# EAGLE design schematics (EAGLE 9.3.2)
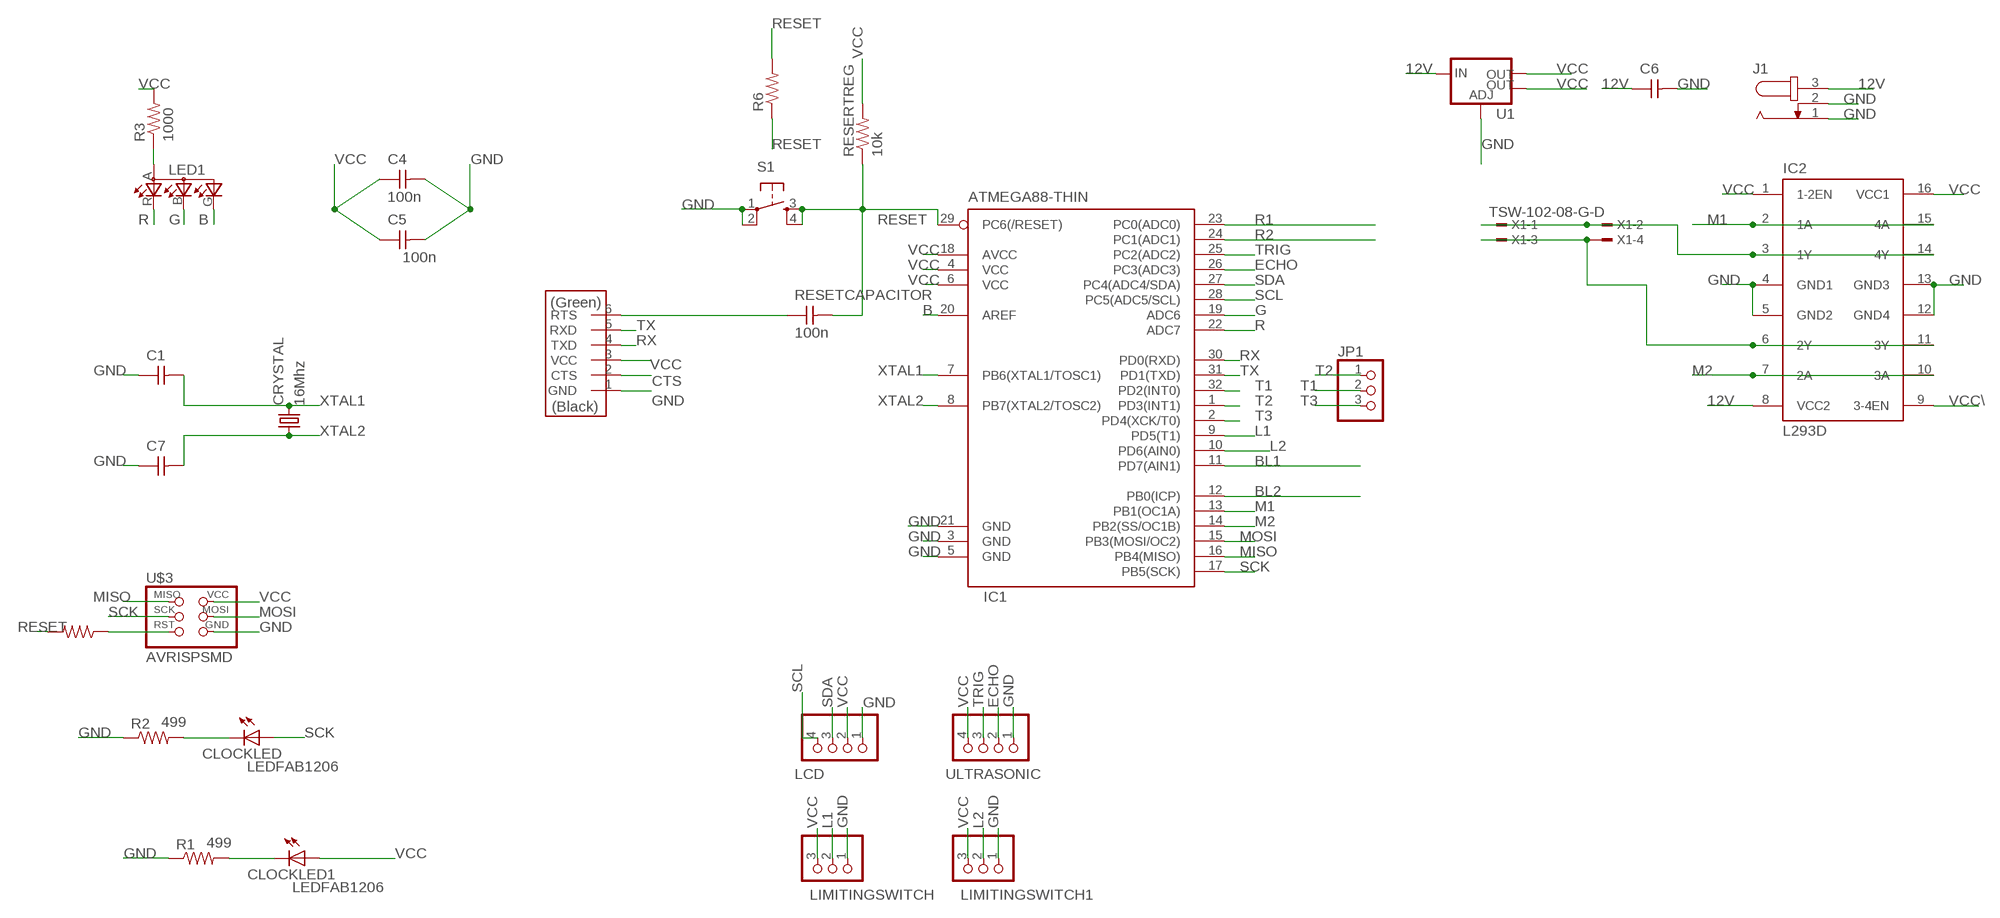
[diagram p0: schematic, sheet 1]

## Parts
C1  CAP-UNPOLARIZEDFAB  [C1206FAB]
C4  100n  CAP-UNPOLARIZEDFAB  [C1206FAB]
C5  100n  CAP-UNPOLARIZEDFAB  [C1206FAB]
C6  CAP-UNPOLARIZEDFAB  [C1206FAB]
C7  CAP-UNPOLARIZEDFAB  [C1206FAB]
CLOCKLED  LEDFAB1206  [LED1206FAB]
CLOCKLED1  LEDFAB1206  [LED1206FAB]
CRYSTAL  16Mhz  CSM-7X-DU  [CSM-7X-DU]
IC1  ATMEGA88-THIN  [TQFP32-08THIN]
IC2  L293D  [DIL16]
J1  JACK-PLUG1  [SPC4078]
JP1  PINHD-1X31X03_SMT  [1X03_SMT]
LCD  PINHD-1X41X04_SMT  [1X04_SMT]
LED1  LEDRGBOLD  [P-LCC-4-3]
LIMITINGSWITCH  PINHD-1X31X03_SMT  [1X03_SMT]
LIMITINGSWITCH1  PINHD-1X31X03_SMT  [1X03_SMT]
R1  499  RES-US1206FAB  [R1206FAB]
R2  499  RES-US1206FAB  [R1206FAB]
R3  1000  RES-US1206FAB  [R1206FAB]
R4  1000  RES-US1206FAB  [R1206FAB]
R6  1000  RES-US1206FAB  [R1206FAB]
RESERTREG  10k  RES-US1206FAB  [R1206FAB]
RESETCAPACITOR  100n  CAP-UNPOLARIZEDFAB  [C1206FAB]
S1  6MM_SWITCH6MM_SWITCH  [6MM_SWITCH]
U1  V_REG_LM1117SOT223  [SOT223]
U$2  FTDI-SMD-HEADER  [1X06SMD]
U$3  AVRISPSMD  [2X03SMD]
ULTRASONIC  PINHD-1X41X04_SMT  [1X04_SMT]
X1  TSW-102-08-G-D  [TSW-102-XX-G-D]

## Nets
12V: C6.1 IC2.8(VCC2) J1.3 U1.3(IN)
B: IC1.20(AREF) LED1.G(CGREEN)
BL1: IC1.11(PD7(AIN1))
BL2: IC1.12(PB0(ICP))
CTS: U$2.2(CTS)
ECHO: IC1.26(PC3(ADC3)) ULTRASONIC.2
G: IC1.19(ADC6) LED1.B(CBLUE)
GND: C1.1 C4.2 C5.2 C6.2 C7.1 IC1.3(GND) IC1.5(GND) IC1.21(GND) IC2.4(GND1) IC2.5(GND2) IC2.12(GND4) IC2.13(GND3) J1.1 J1.2 LCD.1 LIMITINGSWITCH1.1 LIMITINGSWITCH.1 R1.1 R2.1 S1.1(P) S1.2(P1) U1.1(ADJ) U$2.1(GND) U$3.6(GND) ULTRASONIC.1
L1: IC1.9(PD5(T1)) LIMITINGSWITCH.2
L2: IC1.10(PD6(AIN0)) LIMITINGSWITCH1.2
M1: IC1.13(PB1(OC1A)) IC2.2(1A) IC2.15(4A)
M2: IC1.14(PB2(SS/OC1B)) IC2.7(2A) IC2.10(3A)
MISO: IC1.16(PB4(MISO)) U$3.1(MISO)
MOSI: IC1.15(PB3(MOSI/OC2)) U$3.4(MOSI)
N$1: LED1.A(A2) R3.1
N$3: CLOCKLED.2(C) R2.2
N$5: CLOCKLED1.2(C) R1.2
N$6: R4.1 U$3.5(RST)
N$7: RESETCAPACITOR.1 U$2.6(RTS)
N$32: IC2.3(1Y) IC2.14(4Y) X1.1 X1.2
N$34: IC2.6(2Y) IC2.11(3Y) X1.3 X1.4
R: IC1.22(ADC7) LED1.R(CRED)
R1: IC1.23(PC0(ADC0))
R2: IC1.24(PC1(ADC1))
RESET: IC1.29(PC6(/RESET)) R4.2 R6.1 R6.2 RESERTREG.1 RESETCAPACITOR.2 S1.3(S) S1.4(S1)
RX: IC1.30(PD0(RXD)) U$2.4(TXD)
SCK: CLOCKLED.1(A) IC1.17(PB5(SCK)) U$3.3(SCK)
SCL: IC1.28(PC5(ADC5/SCL)) LCD.4
SDA: IC1.27(PC4(ADC4/SDA)) LCD.3
T1: IC1.32(PD2(INT0)) JP1.2
T2: IC1.1(PD3(INT1)) JP1.1
T3: IC1.2(PD4(XCK/T0)) JP1.3
TRIG: IC1.25(PC2(ADC2)) ULTRASONIC.3
TX: IC1.31(PD1(TXD)) U$2.5(RXD)
VCC: C4.1 C5.1 CLOCKLED1.1(A) IC1.4(VCC) IC1.6(VCC) IC1.18(AVCC) IC2.1(1-2EN) IC2.16(VCC1) LCD.2 LIMITINGSWITCH1.3 LIMITINGSWITCH.3 R3.2 RESERTREG.2 U1.2(OUT) U1.4(OUT) U$2.3(VCC) U$3.2(VCC) ULTRASONIC.4
VCC\: IC2.9(3-4EN)
XTAL1: C1.2 CRYSTAL.2 IC1.7(PB6(XTAL1/TOSC1))
XTAL2: C7.2 CRYSTAL.1 IC1.8(PB7(XTAL2/TOSC2))

## Library data of the parts
C1 C4-C7 RESETCAPACITOR = fab:CAP-UNPOLARIZED
CLOCKLED CLOCKLED1 = fab:LED: LED
CRYSTAL = 01_FAB_Hello:CSM-7X-DU: SMD CRYSTAL Source: www.ecsxtal.com .. Crystal 3.6864MHz CSM_7X_DU.PDF; OC_FARNELL: unknown; OC_NEWARK: unknown
IC1 = fab:ATMEGA88-THIN
IC2 = st-microelectronics:L293D: PUSH-PULL 4 CHANNEL DRIVER; MPN: L293D; OC_FARNELL: 9589619; OC_NEWARK: 56P8249
J1 = con-jack:JACK-PLUG: DC POWER JACK Power Jack, DC, Right Angle, Through Hole, Rated 5A at 16VDC, PC Terminals Distributor: Farnell (www.Farnell.de) Drawing: 84N1161.pdf / 84N1162.pdf Manufacturer: SPC Technology (www.spctechnology.com) Type: SPC4077 / SPC 4078; OC_FARNELL: unknown; OC_NEWARK: unknown
JP1 LIMITINGSWITCH LIMITINGSWITCH1 = smd_con:PINHD-1X3: PIN HEADER
LCD ULTRASONIC = smd_con:PINHD-1X4: PIN HEADER
LED1 = fab:LEDRGBOLD: OSRAM Hyper Multi TOPLED® Hyper-Bright LED LATB T686 Source: http://www.osram.convergy.de/
R1-R4 R6 RESERTREG = fab:RES-US: Resistor (US Symbol) Variants with postfix FAB are widened to allow the routing of internal traces
S1 = fab:6MM_SWITCH: OMRON SWITCH
U1 = fab:V_REG_LM1117: Voltage Regulator LM1117 Standard adjustable voltage regulator but in SMD form. Spark Fun Electronics SKU : COM-00595; PROD_ID: VREG-08170
U$2 = fab:FTDI-SMD-HEADER
U$3 = fab:AVRISP
X1 = con-samtec:TSW-102-*-G: THROUGH-HOLE .025" SQ POST HEADER Source: Samtec TSW.pdf; MF: Samtec Inc.; MPN: TSW-102-07-G-D

## Board
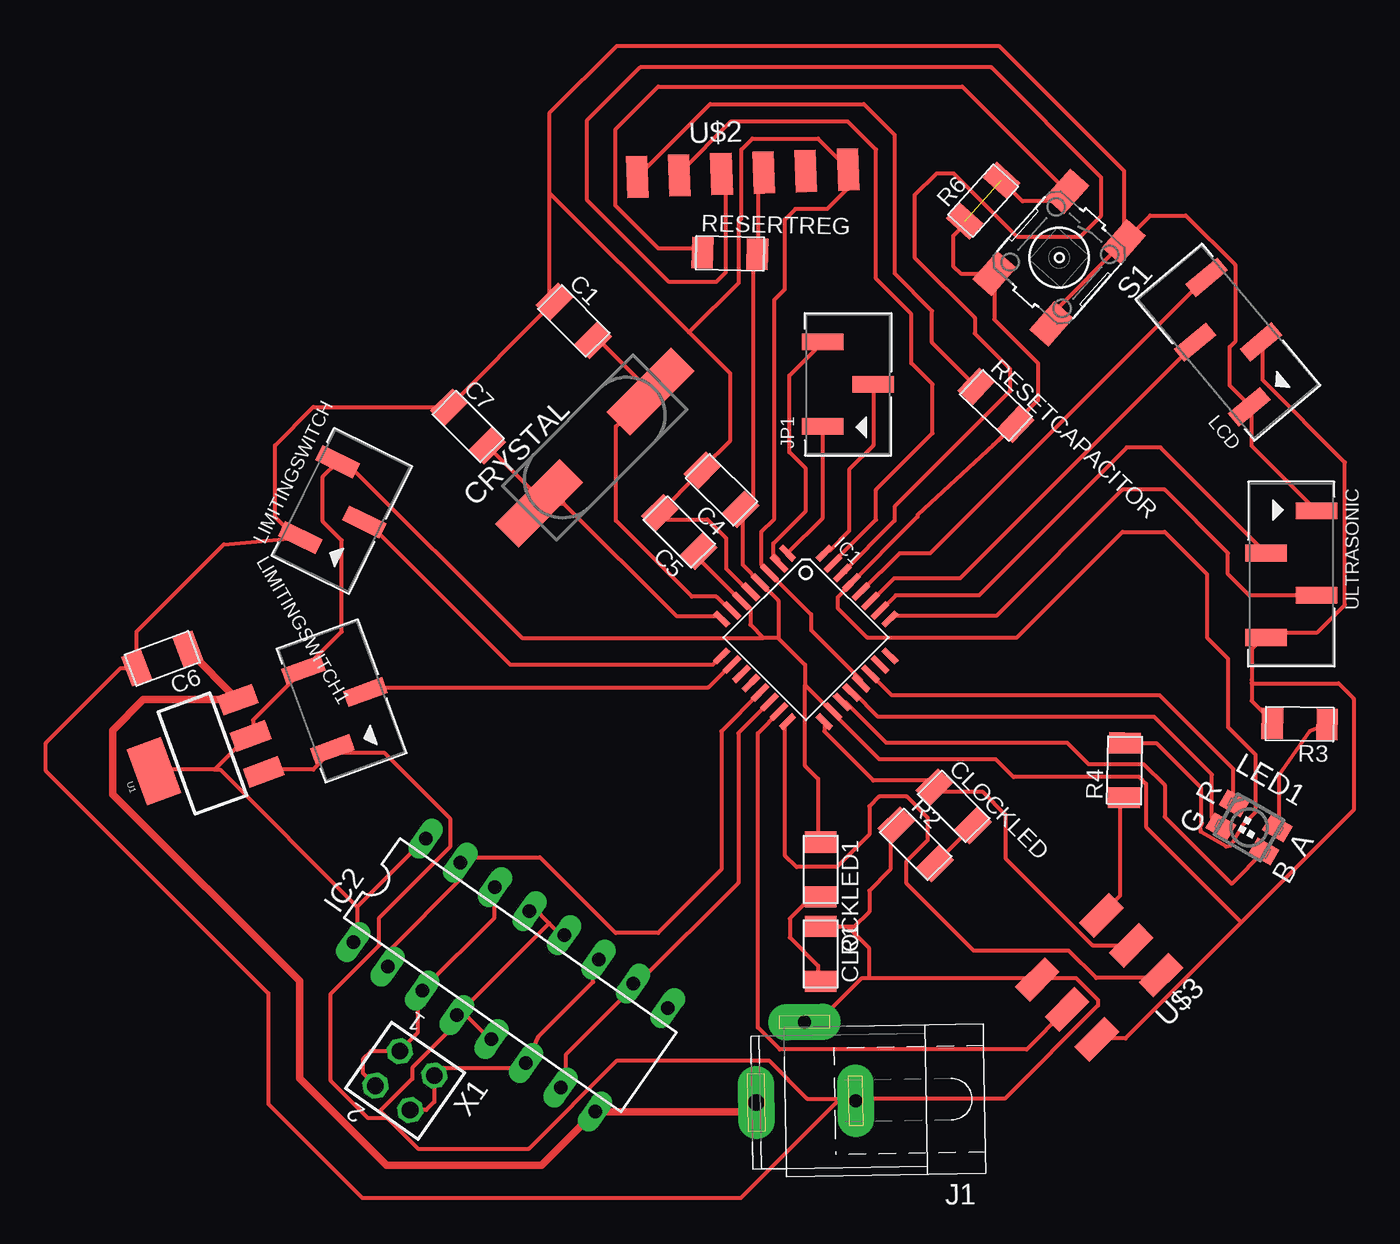
[diagram p1: board, top side]

No outline drawn. Coordinates in mm, seen from the top.
Copper layers (1*16): Top 0.035mm / dielectric 1.5mm / Bottom 0.035mm
Design rules "default *": minimum track width 10mil, minimum drill 0.35mm, track to track 16mil, track to pad 8mil, pad to pad 8mil, via to via 8mil, smd to smd 8mil, copper to edge 40mil, drill to drill 6mil, minimum pad ring 10mil, minimum via ring 8mil, stop-mask expansion 4mil, vias tented up to drill 0mil, thermal gap 10mil

### Footprints (pad centres in the part's own frame; a part is rotated, then mirrored left to right if it is on the bottom)
C1206FAB = smd 1.27 x 1.905: 1 -1.651,0; 2 1.651,0
LED1206FAB = smd 1.27 x 1.905: 1 -1.651,0; 2 1.651,0
CSM-7X-DU = smd 5.5 x 2: 1 -4.75,0; 2 4.75,0
TQFP32-08THIN = smd 1.118 x 0.356: 1 -4.369,2.8; 8 -4.369,-2.8; 17 4.369,-2.8; 24 4.369,2.8 | smd 1.27 x 0.356: 2 -4.293,2; 3 -4.293,1.2; 4 -4.293,0.4; 5 -4.293,-0.4; 6 -4.293,-1.2; 7 -4.293,-2; 18 4.293,-2; 19 4.293,-1.2; 20 4.293,-0.4; 21 4.293,0.4; 22 4.293,1.2; 23 4.293,2 | smd 0.356 x 1.118: 9 -2.8,-4.369; 16 2.8,-4.369; 25 2.8,4.369; 32 -2.8,4.369 | smd 0.356 x 1.27: 10 -2,-4.293; 14 1.2,-4.293; 15 2,-4.293; 26 2,4.293; 27 1.2,4.293; 31 -2,4.293 | smd 0.35 x 1.27: 11 -1.2,-4.293; 12 -0.4,-4.293; 13 0.4,-4.293; 28 0.4,4.293; 29 -0.4,4.293; 30 -1.2,4.293
DIL16 = drill 0.813 long: 1 -8.89,-3.81; 2 -6.35,-3.81; 3 -3.81,-3.81; 4 -1.27,-3.81; 5 1.27,-3.81; 6 3.81,-3.81; 7 6.35,-3.81; 8 8.89,-3.81; 9 8.89,3.81; 10 6.35,3.81; 11 3.81,3.81; 12 1.27,3.81; 13 -1.27,3.81; 14 -3.81,3.81; 15 -6.35,3.81; 16 -8.89,3.81
SPC4078 = drill 0.8 pad 2.184 long: 1 -3,0; 2 0,-4.8 | drill 1 pad 2.184 long: 3 3,0
1X03_SMT = smd 1 x 2.5: 1 -2.54,1.52; 2 0,-1.52; 3 2.54,1.52
1X04_SMT = smd 1 x 2.5: 1 -3.81,1.52; 2 -1.27,-1.52; 3 1.27,1.52; 4 3.81,-1.52
P-LCC-4-3 = smd 1.1 x 1.5: A -0.8,1.5; B 0.8,1.5; G 0.8,-1.5; R -0.8,-1.5
R1206FAB = smd 1.27 x 1.905: 1 -1.651,0; 2 1.651,0
6MM_SWITCH = smd 2.286 x 1.524: 1 -3.302,2.286; 2 3.302,2.286; 3 -3.302,-2.286; 4 3.302,-2.286
SOT223 = smd 1.219 x 2.235: 1 -2.311,-3.099; 2 0,-3.099; 3 2.311,-3.099 | smd 3.6 x 2.2: 4 0,3.099
1X06SMD = smd 2.54 x 1.27: 1 0,6.35; 2 0,3.81; 3 0,1.27; 4 0,-1.27; 5 0,-3.81; 6 0,-6.35
2X03SMD = smd 2.54 x 1.27: 1 -2.54,2.54; 2 2.92,2.54; 3 -2.54,0; 4 2.92,0; 5 -2.54,-2.54; 6 2.92,-2.54
TSW-102-XX-G-D = drill 1 pad 1.5 octagon: 1 1.27,-1.27; 2 1.27,1.27; 3 -1.27,-1.27; 4 -1.27,1.27

### Placement (x,y rotation side)
C1  45.72,59.69 315 top
C4  54.61,49.53 135 top
C5  52.07,46.99 135 top
C6  20.95,39.37 200.5 top
C7  39.37,53.34 315 top
CLOCKLED  68.58,30.48 315 top
CLOCKLED1  60.58,26.67 270 top
CRYSTAL  46.99,52.07 45 top
IC1  59.69,40.64 315 top
IC2  41.91,20.32 325 top
J1  59.69,12.7 181 top
JP1  62.23,55.88 90 top
LCD  85.09,58.42 130 top
LED1  86.36,29.21 240 top
LIMITINGSWITCH  31.75,48.26 63.8 top
LIMITINGSWITCH1  31.75,36.83 110 top
R1  60.58,21.59 270 top
R2  66.29,28.19 315 top
R3  89.41,35.43 179 top
R4  78.87,32.64 89 top
R6  70.36,66.93 48 top
RESERTREG  55.12,63.75 358.7 top
RESETCAPACITOR  71.12,54.61 316.5 top
S1  74.93,63.5 228.5 top
U1  23.37,33.66 110 top
U$2  55.88,68.58 272 top
U$3  77.47,20.32 225 top
ULTRASONIC  88.9,44.45 270 top
X1  35.56,13.97 145 top

### Tracks (layer width: path | path; a pad name or v marks a point on that pad's centre or on a via)
12V
  Top 0.254: 25.43,36.65 U1.3 | 56.13,12.22 56.46,12.55 J1.3 | 47.22,12.22 IC2.8
  Top 0.457: 25.34,37.03 U1.3 25.47,36.9 | J1.3 56.14,12.1 IC2.8 43.77,8.87 34.44,8.87 29.21,14.1 29.21,19.96 17.96,31.21 17.96,35.05 19.82,36.9 25.47,36.9 | 25.47,36.9 22.5,39.88 C6.1 22.63,39.82 22.63,39.75
B
  Top 0.254: LED1.G 84.53,29.39 84.12,29.79 84.12,32.38 80.64,35.87 64.03,35.87 62.57,37.32 IC1.20
ECHO
  Top 0.254: IC1.26 64.18,42.26 65.1,43.18 70.1,43.18 78.99,52.07 81.03,52.07 ULTRASONIC.2
G
  Top 0.254: IC1.19 62.07,36.76 64.52,34.31 75.41,34.31 76.7,33.02 80.01,33.02 81.28,31.75 81.28,29.85 85.31,25.82 LED1.B
GND
  Top 0.254: J1.2 59.77,17.5 60.43,17.5 63.07,20.14 63.5,20.14 | 63.5,20.14 73.3,20.14 U$3.6 73.64,20.14 75.95,20.14 77.27,18.82 77.27,18.49 71.65,12.88 62.74,12.88 J1.1 62.41,12.88 61.75,12.88 | U1.1 27.08,32.69 30.05,32.69 31.04,33.68 LIMITINGSWITCH1.1 31.37,33.68 34.34,33.68 38.3,29.72 38.3,28.07 34.01,23.77 34.01,22.12 31.09,19.2 31.09,13.97 33.35,11.71 34.52,11.71 | 38.96,18.16 40.62,16.51 IC2.5 | 44.25,23.44 43.26,24.43 IC2.13 | 44.25,23.44 44.91,22.78 IC2.12 | 44.25,23.44 38.96,18.16 | 38.96,18.16 IC2.4 39.06,17.8 35.99,14.73 35.99,14.07 34.07,12.15 34.52,11.71 | 61.75,12.88 59.77,12.88 57.45,15.19 48.34,15.19 43.03,9.88 36.35,9.88 34.52,11.71 | ULTRASONIC.1 90.14,48.54 86.51,52.17 86.51,54.48 LCD.1 86.18,54.81 85.19,55.8 85.19,58.12 85.52,58.45 85.52,63.07 82.55,66.04 80.41,66.04 S1.1 | 56.46,43.26 IC1.5 56.28,43.39 54.89,44.78 54.89,46.62 53.76,47.75 51.31,47.75 C5.2 | 57.78,44.25 IC1.3 | 57.46,44.57 IC1.3 | U$2.1 62.08,69.01 60.43,70.66 56.46,70.66 55.8,70 55.8,65.84 55.65,65.68 55.65,62 52.65,59 | 17.17,29.39 13.95,32.61 13.95,34.29 18.45,38.79 C6.2 19.41,41 24.66,46.24 LIMITINGSWITCH.1 29.34,46.28 27.74,47.88 27.74,52.2 30.05,54.51 C7.1 | 17.17,29.39 27.33,19.23 27.33,12.57 32.99,6.91 55.78,6.91 61.75,12.88 | 50.85,48.21 C5.2 | 17.17,29.39 | C5.2 | C5.2 53.27,50.52 53.49,50.52 C4.2 53.49,50.85 55.14,52.5 55.14,56.52 52.65,59 | IC1.3 56.99,45.03 56.99,46.99 57.78,47.78 57.78,60.96 58.42,61.59 58.42,65.79 59.05,66.42 60.96,66.42 62.23,67.69 U$2.1 | IC1.21 63.01,38.08 60,41.09 60,42.02 IC1.3 | U$2.1 62.08,68.65 62.23,68.5 | 44.25,67.41 44.25,72.19 48.31,76.25 71.3,76.25 78.83,68.72 S1.1
  Top 0.254: C7.1 | C7.1 44.25,60.55 | 44.25,60.55 C1.1 | 44.25,67.41 52.65,59 | S1.1 74.45,60.08 S1.2 | 63.5,20.14 63.5,21.92 62.18,23.24 R1.1 62.61,23.24 63.5,24.13 63.5,25.4 64.77,26.67 64.77,28.45 65.13,28.8 R2.1 | 44.25,67.41 44.25,60.55
L1
  Top 0.254: IC1.9 54.08,38.99 41.91,38.99 33.3,47.6 LIMITINGSWITCH.2
L2
  Top 0.254: IC1.10 55.14,38.96 53.82,37.64 33.35,37.64 LIMITINGSWITCH1.2
M1
  Top 0.254: 56.79,37.31 IC1.13 54.61,34.99 54.61,26.67 50.8,22.86 48.23,22.86 43.69,27.41 38.96,27.41 IC2.15 38.89,26.07 34.67,21.84 34.67,21.13 IC2.2
M2
  Top 0.254: 57.45,36.65 IC1.14 55.63,34.88 55.63,25.88 49.56,19.81 | 49.78,19.83 49.56,19.81 | 49.56,19.81 IC2.10 49.2,19.48 45.24,15.52 45.24,13.87 IC2.7
MISO
  Top 0.254: IC1.16 58.45,35.33 58.45,27.51 59.13,26.82 61.54,26.82 63.5,28.78 63.5,30.48 64.09,31.07 65.76,31.07 67.03,29.79 67.03,28.45 65.75,27.17 65.75,25.84 69.8,21.79 75.51,21.79 77.17,20.14 80.9,20.14 U$3.1
MOSI
  Top 0.254: IC1.15 58.07,36.15 56.79,34.87 56.79,17.17 58.12,15.85 72.97,15.85 75.29,18.16 U$3.4
N$1
  Top 0.254: LED1.A 88.16,29.39 88.16,32.36 90,34.98 R3.1
N$3
  Top 0.254: 69.67,29.06 CLOCKLED.2 R2.2
N$5
  Top 0.254: R1.2 60.43,20.14 60.43,20.88 58.73,22.58 58.73,23.72 59.77,24.77 60.43,24.77 CLOCKLED1.2
N$6
  Top 0.254: R4.1 78.58,30.73 78.58,25.09 77.6,24.11 U$3.5
N$7
  Top 0.254: U$2.6 49.86,68.68 53.92,72.75 63.17,72.75 65.03,70.88 65.03,62.54 67.28,60.29 67.28,58.39 RESETCAPACITOR.1
N$32
  Top 0.254: 35.33,15.85 X1.1 | IC2.14 40.95,25.43 40.95,23.77 36.65,19.48 IC2.3 36.32,19.15 36.32,16.84 35.25,15.77 X1.1 | X1.1 33.52,15.74 33.02,15.24 33.02,14.43 X1.2
N$34
  Top 0.254: IC2.11 46.89,21.13 46.89,19.91 43.57,16.59 IC2.6 42.39,14.73 37.78,14.73 X1.3 37.33,12.69 36.84,12.2 X1.4
R
  Top 0.254: IC1.22 63.73,38.3 64.87,37.16 80.97,37.16 85.42,32.72 85.42,30.66 LED1.R
RESET  (1 unrouted)
  Top 0.254: RESERTREG.1 53.16,64.06 50.8,64.06 48.21,66.65 48.21,71.2 50.8,73.79 69.11,73.79 S1.3 74.8,66.89 72.73,66.89 R6.2 | R4.2 80.78,34.29 83.46,31.6 83.46,29.52 83.53,29.46 83.38,29.21 83.45,28.95 84.99,28.06 85.25,28.13 85.94,29.32 86.74,30.12 86.74,33.6 85.09,35.25 85.09,39.37 83.82,40.64 83.82,44.45 81.28,46.99 78.74,46.99 72.39,40.64 63.38,40.64 61.6,42.42 61.6,43.05 61.98,43.43 | IC1.29 62.44,43.9 61.98,43.43 | 61.98,43.43 61.98,43.48 66.41,47.91 66.41,48.02 70.97,52.23 | RESETCAPACITOR.2 70.97,52.23 | R6.1 69.25,65.5 68.55,64.8 68.55,63 69.01,62.54 S1.4 71.03,59.78 73.66,57.15 73.66,54.92 70.97,52.23
RX
  Top 0.254: U$2.4 54.86,68.28 54.86,62.61 54.28,62.03 51.46,62.03 46.53,66.95 46.53,71.78 49.71,74.95 70.84,74.95 77.47,68.33 77.47,66.04 76.2,64.77 72.39,64.77 68.58,68.58 67.56,68.58 66.23,67.25 66.23,63.5 69.85,59.88 69.85,58.93 71.97,56.81 71.97,55.46 65.02,48.51 65.02,47.67 IC1.30 62.08,44.58
SCK
  Top 0.254: IC1.17 60.8,34.98 63.75,32.03 67.03,32.03 67.36,31.7 CLOCKLED.1 67.69,31.37 70.31,31.37 71.7,29.97 71.7,27.36 76.94,22.12 79.25,22.12 U$3.3
SCL
  Top 0.254: 63.01,43.4 IC1.28 65.34,45.72 67.18,45.72 83.54,62.08 LCD.4
SDA
  Top 0.254: IC1.27 63.73,42.93 65,44.2 68.96,44.2 82.88,58.12 LCD.3
T1
  Top 0.254: JP1.2 63.75,52.2 62.29,50.74 62.29,47.05 61.09,45.85 61.05,45.85 60.91,45.71 IC1.32
T2
  Top 0.254: IC1.1 60.71,47.84 JP1.1
T3
  Top 0.254: IC1.2 58.07,45.29 57.73,45.63 57.73,46.3 59.69,48.26 59.69,50.8 58.7,51.79 58.7,56.41 JP1.3
TRIG
  Top 0.254: IC1.25 65.05,41.94 71.14,41.94 78.74,49.53 81.28,49.53 85.09,45.72 85.09,44.45 86.36,43.18 ULTRASONIC.3
TX
  Top 0.254: IC1.31 61.42,45.24 63.91,47.73 63.91,49.53 67.31,52.93 67.31,55.88 66.04,57.15 66.04,60.1 63.91,62.23 63.91,70 62.2,71.7 55.19,71.7 52.17,68.68 U$2.5
VCC
  Top 0.254: 86.51,38.1 86.51,39.95 87.17,40.62 ULTRASONIC.4 87.5,40.95 90.47,40.95 92.13,42.6 92.13,51.18 87.17,56.13 87.17,58.12 LCD.2 | 86.51,37.87 86.51,36.83 87.76,35.59 R3.2 | 86.51,38.1 86.51,37.87 | 85.9,23.5 92.66,30.25 92.66,36.96 91.75,37.87 86.51,37.87 | 85.9,23.5 78.92,16.51 77.27,16.51 U$3.2 | RESERTREG.2 56.79,63.73 56.79,68.02 57.12,68.35 U$2.3 | C5.1 53.13,45.47 55.78,42.83 IC1.6 56.13,42.6 56.35,42.38 56.35,41.41 57.15,40.62 | 59.64,37.77 61.09,36.32 IC1.18 61.42,35.99 64.11,33.3 71.12,33.3 72.19,32.23 79.76,32.23 80.16,31.83 80.16,29.24 85.9,23.5 | CLOCKLED1.1 60.43,28.4 60.43,32.13 59.64,32.92 59.64,37.77 | 55.8,48.21 55.8,48.25 | 55.8,48.25 C4.1 55.88,48.26 55.88,45.02 IC1.4 58.04,42.86 58.04,40.64 58.01,40.62 | 56.79,63.4 RESERTREG.2 | 32.69,24.43 32.69,22.45 IC2.1 | 32.69,24.43 36.65,28.4 IC2.16 | 24.11,32.69 20.47,32.69 U1.4 | 24.11,32.69 26.09,34.67 U1.2 26.42,35 26.42,35.66 29.39,38.63 LIMITINGSWITCH1.3 29.72,38.96 31.75,41 31.75,46.48 30.61,47.62 30.61,50.31 LIMITINGSWITCH.3 | 32.69,24.43 24.43,32.69 24.11,32.69 | 57.15,40.62 42.6,40.62 32,51.21 LIMITINGSWITCH.3 | RESERTREG.2 56.52,63.46 56.52,48.96 55.8,48.25 | 86.51,38.1 | 31.06,51.21 LIMITINGSWITCH.3 | 58.01,40.62 57.15,40.62 | 58.01,40.62 59.64,38.99 59.64,37.77
XTAL1
  Top 0.254: IC1.7 55.14,42.27 54.3,43.1 52.83,43.1 48.26,47.68 48.26,53.34 CRYSTAL.2 47.26,58.52 C1.2
XTAL2
  Top 0.254: CRYSTAL.1 44,48.71 | IC1.8 54.48,41.94 51.89,41.94 45.12,48.71 44.45,48.71 44,48.71 | C7.2 44,48.71